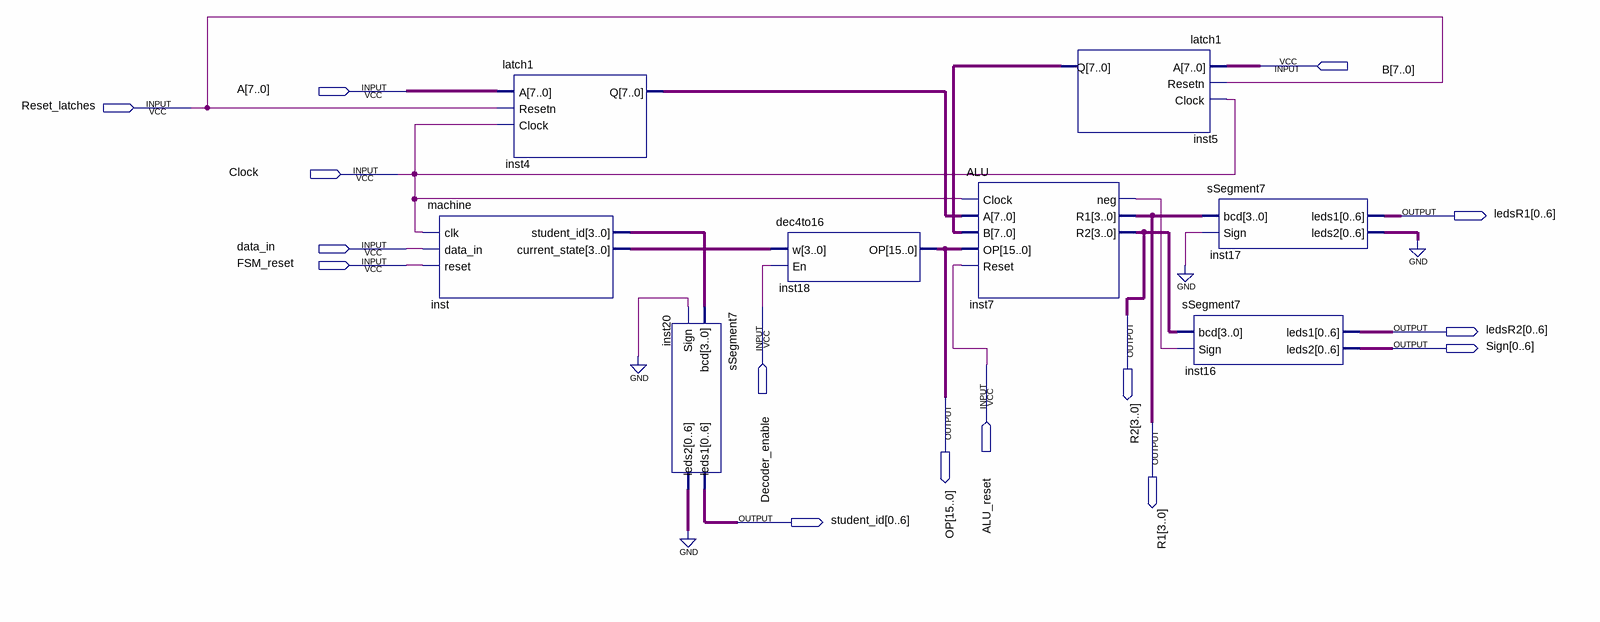
[diagram p0: schematic sheet]
// Quartus schematic backup.bdf as structural Verilog: 8 symbols, 15 pins
module backup (
  input  [7:0] B,
  input  [7:0] A,
  input  Reset_latches,
  input  Clock,
  input  data_in,
  input  FSM_reset,
  input  Decoder_enable,
  input  ALU_reset,
  output [0:6] ledsR1,
  output [3:0] R2,
  output [0:6] ledsR2,
  output [0:6] Sign,
  output [15:0] OP,
  output [3:0] R1,
  output [0:6] student_id
);

  wire inst7_neg;
  wire [3:0] inst_current_state, inst_student_id;
  wire [6:0] inst17_leds2, inst20_leds2;
  wire [7:0] inst4_q, inst5_q;

  machine inst (
    .clk(Clock), .data_in(data_in), .reset(FSM_reset), .student_id(inst_student_id),
    .current_state(inst_current_state));
  latch1 inst4 (.A(A), .Resetn(Reset_latches), .Clock(Clock), .Q(inst4_q));
  sSegment7 inst20 (.bcd(inst_student_id), .Sign(1'b0), .leds1(student_id), .leds2(inst20_leds2));
  dec4to16 inst18 (.w(inst_current_state), .En(Decoder_enable), .OP(OP));
  ALU inst7 (.Clock(Clock), .A(inst4_q), .B(inst5_q), .OP(OP), .Reset(ALU_reset), .neg(inst7_neg), .R1(R1), .R2(R2));
  latch1 inst5 (.A(B), .Resetn(Reset_latches), .Clock(Clock), .Q(inst5_q));
  sSegment7 inst17 (.bcd(R1), .Sign(1'b0), .leds1(ledsR1), .leds2(inst17_leds2));
  sSegment7 inst16 (.bcd(R2), .Sign(inst7_neg), .leds1(ledsR2), .leds2(Sign));
  // also tied to GND on the sheet: {inst20_leds2[0], inst20_leds2[1], inst20_leds2[2], inst20_leds2[3], inst20_leds2[4], inst20_leds2[5], inst20_leds2[6], inst17_leds2[0], inst17_leds2[1], inst17_leds2[2], inst17_leds2[3], inst17_leds2[4], inst17_leds2[5], inst17_leds2[6]}
endmodule
